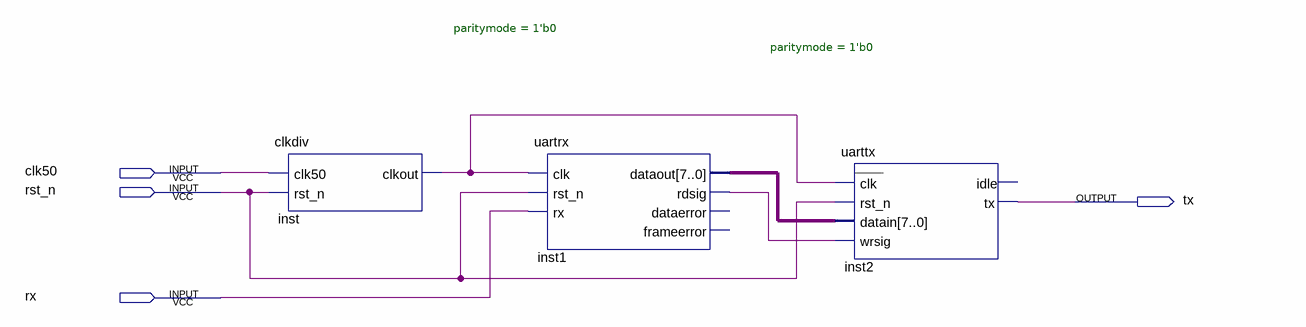
[diagram p0: schematic sheet]
// Quartus schematic uart_test.bdf as structural Verilog: 3 symbols, 4 pins
module uart_test (
  input  clk50,
  input  rst_n,
  input  rx,
  output tx
);

  wire inst1_rdsig, inst_clkout;
  wire [7:0] inst1_dataout;

  clkdiv inst (.clk50(clk50), .rst_n(rst_n), .clkout(inst_clkout));
  uartrx #(.paritymode(1'b0)) inst1 (
    .clk(inst_clkout), .rst_n(rst_n), .rx(rx), .dataout(inst1_dataout), .rdsig(inst1_rdsig));  // open: dataerror, frameerror
  uarttx #(.paritymode(1'b0)) inst2 (
    .clk(inst_clkout), .rst_n(rst_n), .datain(inst1_dataout), .wrsig(inst1_rdsig), .tx(tx));  // open: idle
endmodule
